# EAGLE design goodfet41 (EAGLE 5.08)
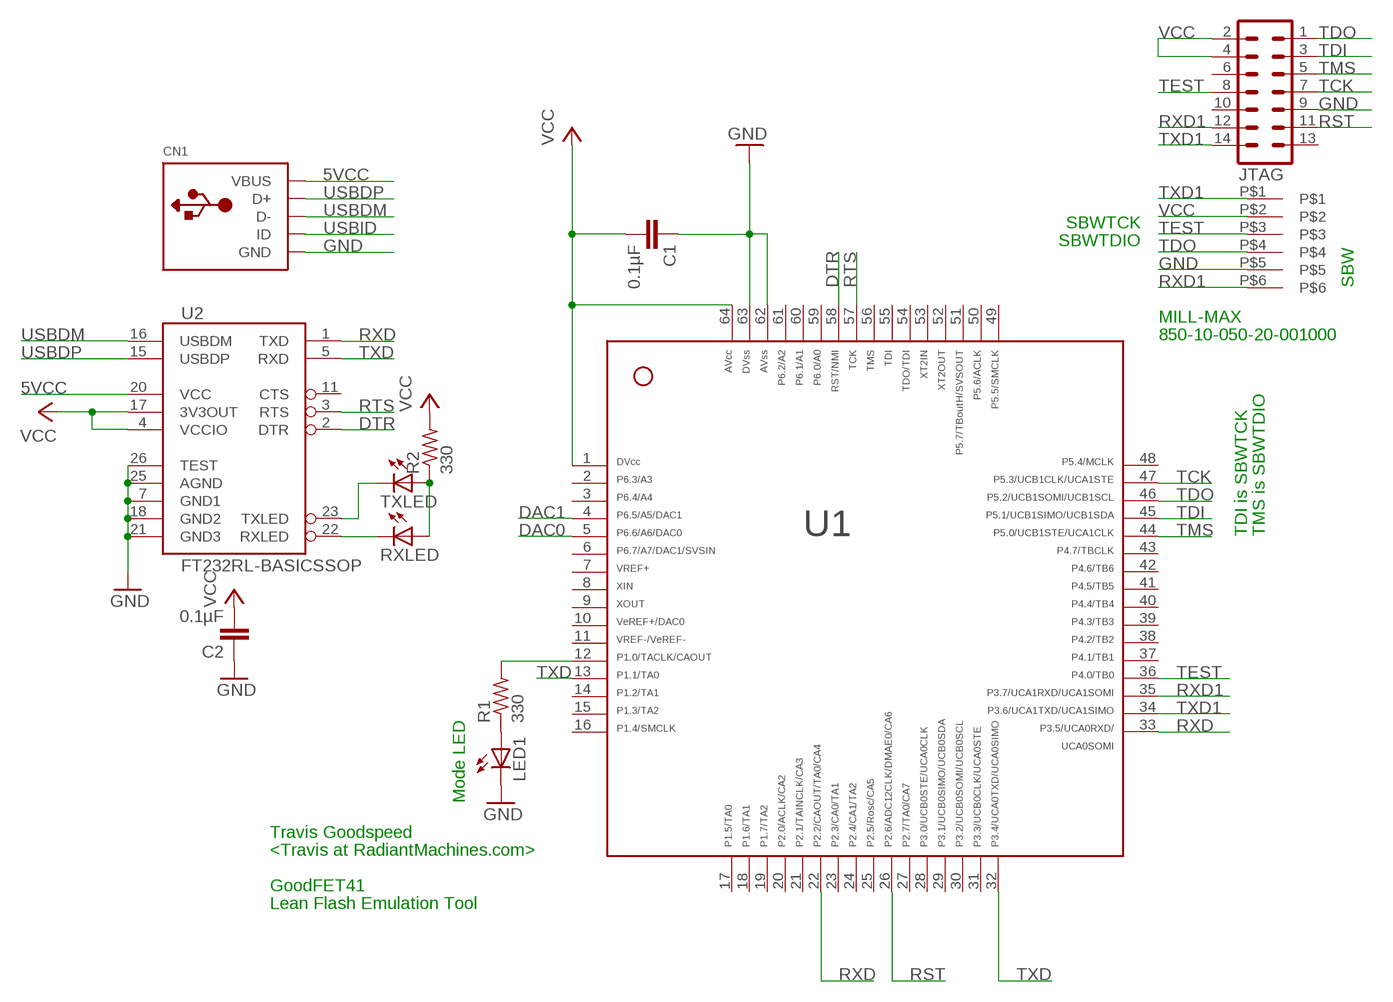
[diagram p0: schematic, sheet 1]

## Parts
C1  0.1µF  C-EUC0603  [C0603]
C2  0.1µF  C-EUC0603  [C0603]
CN1  USBMINIB  [USB-MINIB]
JTAG  MA07-2  [MA07-2]
LED1  LEDCHIP-LED0603  [CHIP-LED0603]
R1  330  R-US_R0603  [R0603]
R2  330  R-US_R0603  [R0603]
RXLED  LEDCHIP-LED0603  [CHIP-LED0603]
TXLED  LEDCHIP-LED0603  [CHIP-LED0603]
U1  F261X---PM64  [PM/PAG64]
U2  FT232RL-BASICSSOP  [SSOP28DB]
U$1  MILLMAX6  [MILLMAX85010004020001000]

## Nets
5VCC: CN1.VBUS U2.20(VCC)
DAC0: U1.5
DAC1: U1.4
DTR: U1.58 U2.2(DTR)
GND: C1.1 C2.1 CN1.GND JTAG.9 LED1.C U1.62 U1.63 U2.7(GND1) U2.18(GND2) U2.21(GND3) U2.25(AGND) U2.26(TEST) U$1.P$5
N$1: R1.2 U1.12
N$2: LED1.A R1.1
N$6: RXLED.C U2.22(RXLED)
N$7: TXLED.C U2.23(TXLED)
N$8: R2.1 RXLED.A TXLED.A
RST: JTAG.11 U1.26
RTS: U1.57 U2.3(RTS)
RXD: U1.22 U1.33 U2.1(TXD)
RXD1: JTAG.12 U1.35 U$1.P$6
TCK: JTAG.7 U1.47
TDI: JTAG.3 U1.45
TDO: JTAG.1 U1.46 U$1.P$4
TEST: JTAG.8 U1.36 U$1.P$3
TMS: JTAG.5 U1.44
TXD: U1.13 U1.32 U2.5(RXD)
TXD1: JTAG.14 U1.34 U$1.P$1
USBDM: CN1.D- U2.16(USBDM)
USBDP: CN1.D+ U2.15(USBDP)
USBID: CN1.ID
VCC: C1.2 C2.2 JTAG.2 JTAG.4 R2.2 U1.1 U1.64 U2.4(VCCIO) U2.17(3V3OUT) U$1.P$2
Unconnected: JTAG.6 JTAG.10 JTAG.13 U1.2 U1.3 U1.6 U1.7 U1.8 U1.9 U1.10 U1.11 U1.14 U1.15 U1.16 U1.17 U1.18 U1.19 U1.20 U1.21 U1.23 U1.24 U1.25 U1.27 U1.28 U1.29 U1.30 U1.31 U1.37 U1.38 U1.39 U1.40 U1.41 U1.42 U1.43 U1.48 U1.49 U1.50 U1.51 U1.52 U1.53 U1.54 U1.55 U1.56 U1.59 U1.60 U1.61 U2.11(CTS)

## Notes on the sheet
- SBWTCK
- SBWTDIO
- SBW
- MILL-MAX
- 850-10-050-20-001000
- TDI is SBWTCK | TMS is SBWTDIO
- Mode LED
- Travis Goodspeed
- <Travis at RadiantMachines.com>
- GoodFET41
- Lean Flash Emulation Tool

## Library data of the parts
C1 C2 = rcl:C-EU: CAPACITOR, European symbol
CN1 = adafruit:USB: USB Connectors USBMINIB - Surface Mount Female Mini-B USB Connector 4UConnector: 06564 By microbuilder.eu Thru-hole RA Female Mini-B USB Connector 4UConnector: 18732 By ladyada.net
JTAG = con-lstb:MA07-2: PIN HEADER
LED1 RXLED TXLED = led:LED: LED OSRAM: - CHIPLED LG R971, LG N971, LY N971, LG Q971, LY Q971, LO R971, LY R971 LH N974, LH R974 LS Q976, LO Q976, LY Q976 LO Q996 - Hyper CHIPLED LW Q18S LB Q993, LB Q99A, LB R99A - SideLED LS A670, LO A670, LY A670, LG A670, LP A670 LB A673, LV A673, LT A673, LW A673 LH A674 LY A675 LS A676, LA A676, LO A676, LY A676, LW A676 LS A679, LY A679, LG A679 - Hyper Micro SIDELED® LS Y876, LA Y876, LO Y876, LY Y876 LT Y87S - SmartLED LW L88C, LW L88S LB L89C, LB L89S, LG L890 LS L89K, LO L89K, LY L89K LS L896, LA L896, LO L896, LY L896 - TOPLED LS T670, LO T670, LY T670, LG T670, LP T670 LSG T670, LSP T670, LSY T670, LOP T670, LYG T670 LG T671, LOG T671, LSG T671 LB T673, LV T673, LT T673, LW T673 LH T674 LS T676, LA T676, LO T676, LY T676, LB T676, LH T676, LSB T676, LW T676 LB T67C, LV T67C, LT T67C, LS T67K, LO T67K, LY T67K, LW E67C LS E67B, LA E67B, LO E67B, LY E67B, LB E67C, LV E67C, LT E67C LW T67C LS T679, LY T679, LG T679 LS T770, LO T770, LY T770, LG T770, LP T770 LB T773, LV T773, LT T773, LW T773 LH T774 LS E675, LA E675, LY E675, LS T675 LS T776, LA T776, LO T776, LY T776, LB T776 LHGB T686 LT T68C, LB T68C - Hyper Mini TOPLED® LB M676 - Mini TOPLED Santana® LG M470 LS M47K, LO M47K, LY M47K Source: http://www.osram.convergy.de LUXEON: - LUMILED® LXK2-PW12-R00, LXK2-PW12-S00, LXK2-PW14-U00, LXK2-PW14-V00 LXK2-PM12-R00, LXK2-PM12-S00, LXK2-PM14-U00 LXK2-PE12-Q00, LXK2-PE12-R00, LXK2-PE12-S00, LXK2-PE14-T00, LXK2-PE14-U00 LXK2-PB12-K00, LXK2-PB12-L00, LXK2-PB12-M00, LXK2-PB14-N00, LXK2-PB14-P00, LXK2-PB14-Q00 LXK2-PR12-L00, LXK2-PR12-M00, LXK2-PR14-Q00, LXK2-PR14-R00 LXK2-PD12-Q00, LXK2-PD12-R00, LXK2-PD12-S00 LXK2-PH12-R00, LXK2-PH12-S00 LXK2-PL12-P00, LXK2-PL12-Q00, LXK2-PL12-R00 Source: www.luxeon.com KINGBRIGHT: KA-3528ASYC Source: www.kingbright.com
R1 R2 = rcl:R-US_: RESISTOR, American symbol
U1 = TI_MSP430_v13:F261X---PM64: ***MSP430F261x***PM64
U2 = SparkFun:FT232RL-BASIC: USB UART This is the simplified version of the FT232RL unit. Only what you need, nothing you don't. Spark Fun Electronics SKU : COM-00650
U$1 = goodlib:MILLMAX6: 6-pin 0.050" header used for MSP430 SBW.

## Board
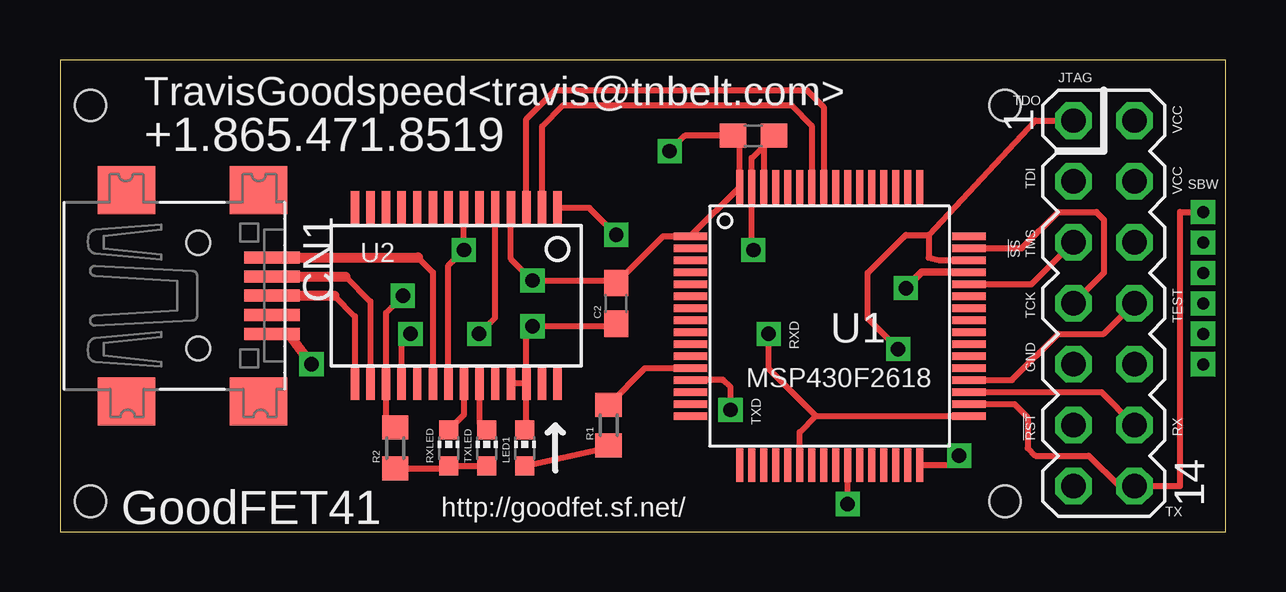
[diagram p1: board, top side]
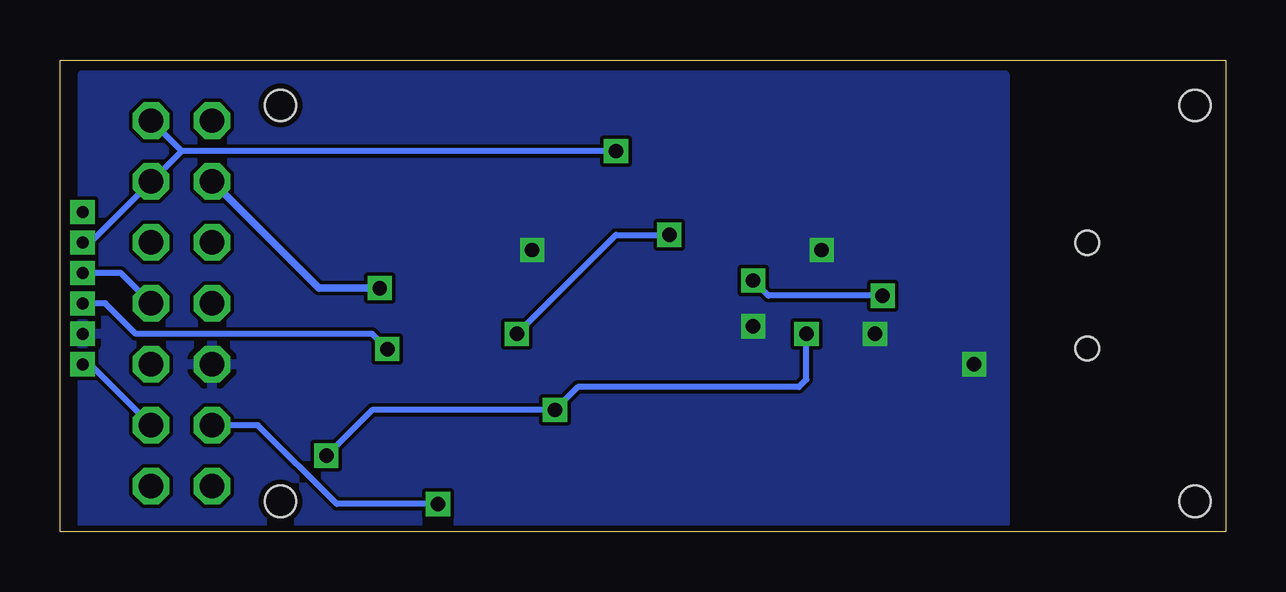
[diagram p2: board, bottom side, seen from below]

Size 48.56 x 19.68 mm. Coordinates in mm from the lower left corner, seen from the top.
Outline: 0,0 48.56,0 48.56,19.68 0,19.68 0,0
Copper layers (1*16): Top 0.035mm / dielectric 1.5mm / Bottom 0.035mm
Design rules "default *": minimum track width 10mil, minimum drill 8mil, track to track 6mil, track to pad 6mil, pad to pad 6mil, via to via 6mil, smd to smd 6mil, copper to edge 10mil, drill to drill 8mil, minimum pad ring 10mil, minimum via ring 8mil, stop-mask expansion 4mil, vias tented up to drill 0mil, thermal gap 10mil
Holes 1.3 mm at 1.27,1.27 1.27,17.78 39.37,17.78 39.37,1.27

### Footprints (pad centres in the part's own frame; a part is rotated, then mirrored left to right if it is on the bottom)
C0603 = smd 1.1 x 1: 1 -0.85,0; 2 0.85,0
USB-MINIB = smd 0.5 x 2.308: D+ 0,4.064; D- -0.8,4.064; GND 1.6,4.064; ID 0.8,4.064; VBUS -1.6,4.064 | smd 2 x 2.4: GND1 -4.4,-2; GND2 -4.4,3.5; GND3 4.4,3.5; GND4 4.4,-2 | hole 1: -2.2,1; 2.2,1
MA07-2 = drill 1.016 octagon: 1 -7.62,-1.27; 2 -7.62,1.27; 3 -5.08,-1.27; 4 -5.08,1.27; 5 -2.54,-1.27; 6 -2.54,1.27; 7 0,-1.27; 8 0,1.27; 9 2.54,-1.27; 10 2.54,1.27; 11 5.08,-1.27; 12 5.08,1.27; 13 7.62,-1.27; 14 7.62,1.27
CHIP-LED0603 = smd 0.8 x 0.8: A 0,-0.75; C 0,0.75
R0603 = smd 1 x 1.1: 1 -0.85,0; 2 0.85,0
PM/PAG64 = smd 1.4 x 0.3: 1 -5.8,3.75; 2 -5.8,3.25; 3 -5.8,2.75; 4 -5.8,2.25; 5 -5.8,1.75; 6 -5.8,1.25; 7 -5.8,0.75; 8 -5.8,0.25; 9 -5.8,-0.25; 10 -5.8,-0.75; 11 -5.8,-1.25; 12 -5.8,-1.75; 13 -5.8,-2.25; 14 -5.8,-2.75; 15 -5.8,-3.25; 16 -5.8,-3.75; 33 5.8,-3.75; 34 5.8,-3.25; 35 5.8,-2.75; 36 5.8,-2.25; 37 5.8,-1.75; 38 5.8,-1.25; 39 5.8,-0.75; 40 5.8,-0.25; 41 5.8,0.25; 42 5.8,0.75; 43 5.8,1.25; 44 5.8,1.75; 45 5.8,2.25; 46 5.8,2.75; 47 5.8,3.25; 48 5.8,3.75 | smd 0.3 x 1.4: 17 -3.75,-5.8; 18 -3.25,-5.8; 19 -2.75,-5.8; 20 -2.25,-5.8; 21 -1.75,-5.8; 22 -1.25,-5.8; 23 -0.75,-5.8; 24 -0.25,-5.8; 25 0.25,-5.8; 26 0.75,-5.8; 27 1.25,-5.8; 28 1.75,-5.8; 29 2.25,-5.8; 30 2.75,-5.8; 31 3.25,-5.8; 32 3.75,-5.8; 49 3.75,5.8; 50 3.25,5.8; 51 2.75,5.8; 52 2.25,5.8; 53 1.75,5.8; 54 1.25,5.8; 55 0.75,5.8; 56 0.25,5.8; 57 -0.25,5.8; 58 -0.75,5.8; 59 -1.25,5.8; 60 -1.75,5.8; 61 -2.25,5.8; 62 -2.75,5.8; 63 -3.25,5.8; 64 -3.75,5.8
SSOP28DB = smd 0.348 x 1.397: 1 -4.225,-3.656; 2 -3.575,-3.656; 3 -2.925,-3.656; 4 -2.275,-3.656; 5 -1.625,-3.656; 6 -0.975,-3.656; 7 -0.325,-3.656; 8 0.325,-3.656; 9 0.975,-3.656; 10 1.625,-3.656; 11 2.275,-3.656; 12 2.925,-3.656; 13 3.575,-3.656; 14 4.225,-3.656; 15 4.225,3.656; 16 3.575,3.656; 17 2.925,3.656; 18 2.275,3.656; 19 1.625,3.656; 20 0.975,3.656; 21 0.325,3.656; 22 -0.325,3.656; 23 -0.975,3.656; 24 -1.625,3.656; 25 -2.275,3.656; 26 -2.925,3.656; 27 -3.575,3.656; 28 -4.225,3.656
MILLMAX85010004020001000 = drill 0.5 pad 0.61 square: P$1 0,3.81; P$2 0,2.54; P$3 0,1.27; P$4 0,0; P$5 0,-1.27; P$6 0,-2.54

### Placement (x,y rotation side)
C1  28.89,16.51 180 top
C2  23.18,9.53 90 top
CN1  4.76,9.84 270 top
JTAG  43.5,9.53 270 top
LED1  19.37,3.49 0 top
R1  22.86,4.45 90 top
R2  13.97,3.49 90 top
RXLED  16.19,3.49 0 top
TXLED  17.78,3.49 0 top
U1  32.07,8.57 0 top
U2  16.51,9.84 180 top
U$1  47.62,9.53 0 top

### Tracks (layer width: path | path; a pad name or v marks a point on that pad's centre or on a via)
5VCC
  Top 0.254: U2.20 15.54,10.82 14.91,11.44
  Top 0.406: CN1.VBUS 14.91,11.44
DTR
  Top 0.254: U2.2 20.09,16.91 20.95,17.78 30.48,17.78 31.32,16.94 U1.58
GND  (via drill 0.6)
  Top 0.254: U2.26 U2.25 | U2.26 19.43,8.32 v19.68,8.57 23.28,8.57 C2.1 | U2.18 14.23,8.2 v14.61,8.26 | U2.7 16.84,13.34 16.83,13.34 v16.83,11.75 16.18,11.11 U2.21 | U2.26 19.43,4.63 LED1.C | U1.62 29.32,16.09 C1.1 28.82,15.59 U1.63 28.82,11.82 v28.89,11.75
  Top 0.406: CN1.GND 9.54,8.24 v10.48,6.99
  pour Bottom: 9.21,0.32 47.62,0.32 47.62,19.05 9.21,19.05
N$1
  Top 0.254: U1.12 24.39,6.82 R1.2
N$2
  Top 0.254: LED1.A 22.76,3.49 R1.1
N$6
  Top 0.254: U2.22 16.84,4.88 RXLED.C
N$7
  Top 0.254: U2.23 17.48,4.54 TXLED.C
N$8
  Top 0.254: R2.1 16.09,2.64 RXLED.A TXLED.A
RST  (via drill 0.6)
  Top 0.254: v32.82,1.16 U1.26
  Bottom 0.254: JTAG.11 40.32,4.45 37.03,1.16 v32.82,1.16
RTS
  Top 0.254: U2.3 19.43,17.21 20.64,18.41 31.11,18.41 31.82,17.71 U1.57
RXD  (via drill 0.6)
  Top 0.254: 31.49,4.82 U1.33 | U1.22 30.82,4.15 31.49,4.82 | U2.1 22.06,13.5 v23.18,12.38 | v29.53,8.26 29.53,6.79 31.49,4.82
  Bottom 0.254: v23.18,12.38 25.4,12.38 v29.53,8.26
RXD1
  Top 0.254: U1.35 43.39,5.82 JTAG.12
  Bottom 0.254: JTAG.12 47.31,6.99 U$1.P$6
TCK
  Top 0.254: U1.47 40.08,11.82 41.59,13.34 43.18,13.34 43.5,13.02 43.5,10.79 JTAG.7
TDI  (via drill 0.6)
  Top 0.305: U1.45 35.91,10.82 v35.24,10.16
  Bottom 0.305: v35.24,10.16 37.78,10.16 JTAG.3
TDO  (via drill 0.6)
  Top 0.254: U1.46 36.62,11.32 36.2,11.43 36.2,12.38 | 36.2,12.38 40.64,17.14 JTAG.1 | v34.92,7.62 33.66,8.89 33.66,10.79 35.24,12.38 36.2,12.38
  Bottom 0.254: U$1.P$4 46.67,9.53 45.4,8.26 35.56,8.26 v34.92,7.62
TEST
  Top 0.254: U1.36 39.66,6.32 41.59,8.26 43.5,8.26 JTAG.8
  Bottom 0.254: JTAG.8 46.04,10.79 U$1.P$3
TMS
  Top 0.254: U1.44 40.48,10.32 JTAG.5
TXD  (via drill 0.6)
  Top 0.254: U2.5 18.14,8.93 v17.46,8.26 | v27.94,5.08 27.94,6.03 27.62,6.35 27.59,6.32 U1.13 | U1.32 37.06,2.77 v37.47,3.17
  Bottom 0.254: v17.46,8.26 17.46,6.35 17.78,6.03 26.99,6.03 v27.94,5.08 35.56,5.08 v37.47,3.17
TXD1
  Top 0.254: U1.34 39.76,5.32 40.32,4.76 40.32,3.49 40.64,3.17 42.86,3.17 44.13,1.91 JTAG.14 46.67,1.91 46.67,13.34 U$1.P$1
USBDM
  Top 0.254: U2.16 12.94,9.61 11.9,10.64
  Top 0.406: CN1.D- 11.9,10.64
USBDP
  Top 0.254: U2.15 12.29,8.99 11.43,9.84
  Top 0.406: CN1.D+ 11.43,9.84
VCC  (via drill 0.6)
  Top 0.254: U2.4 18.79,11.38 v19.68,10.48 23.07,10.48 C2.2 25.12,12.32 U1.1 U1.64 28.32,16.23 C1.2 26.04,16.51 v25.4,15.88 | v14.29,9.84 13.59,9.14 U2.17 13.59,4.73 R2.2
  Bottom 0.254: v14.29,9.84 19.05,9.84 v19.68,10.48 | 43.5,15.88 JTAG.4 47.31,12.06 U$1.P$2 | v25.4,15.88 43.5,15.88 | 43.5,15.88 JTAG.2

### Text on the board
tNames: JTAG | TravisGoodspeed<travis@tnbelt.com> | TDO | VCC | +1.865.471.8519 | VCC | TDI | SBW | !SS | TMS | TEST | TCK | RXD | GND | MSP430F2618 | RX | TXD | !RST | http://goodfet.sf.net/ | TX | GoodFET41